# Altium schematic sheet Sheet1-control.SchDoc
size A3; SheetNumber: 2; SheetTotal: 3
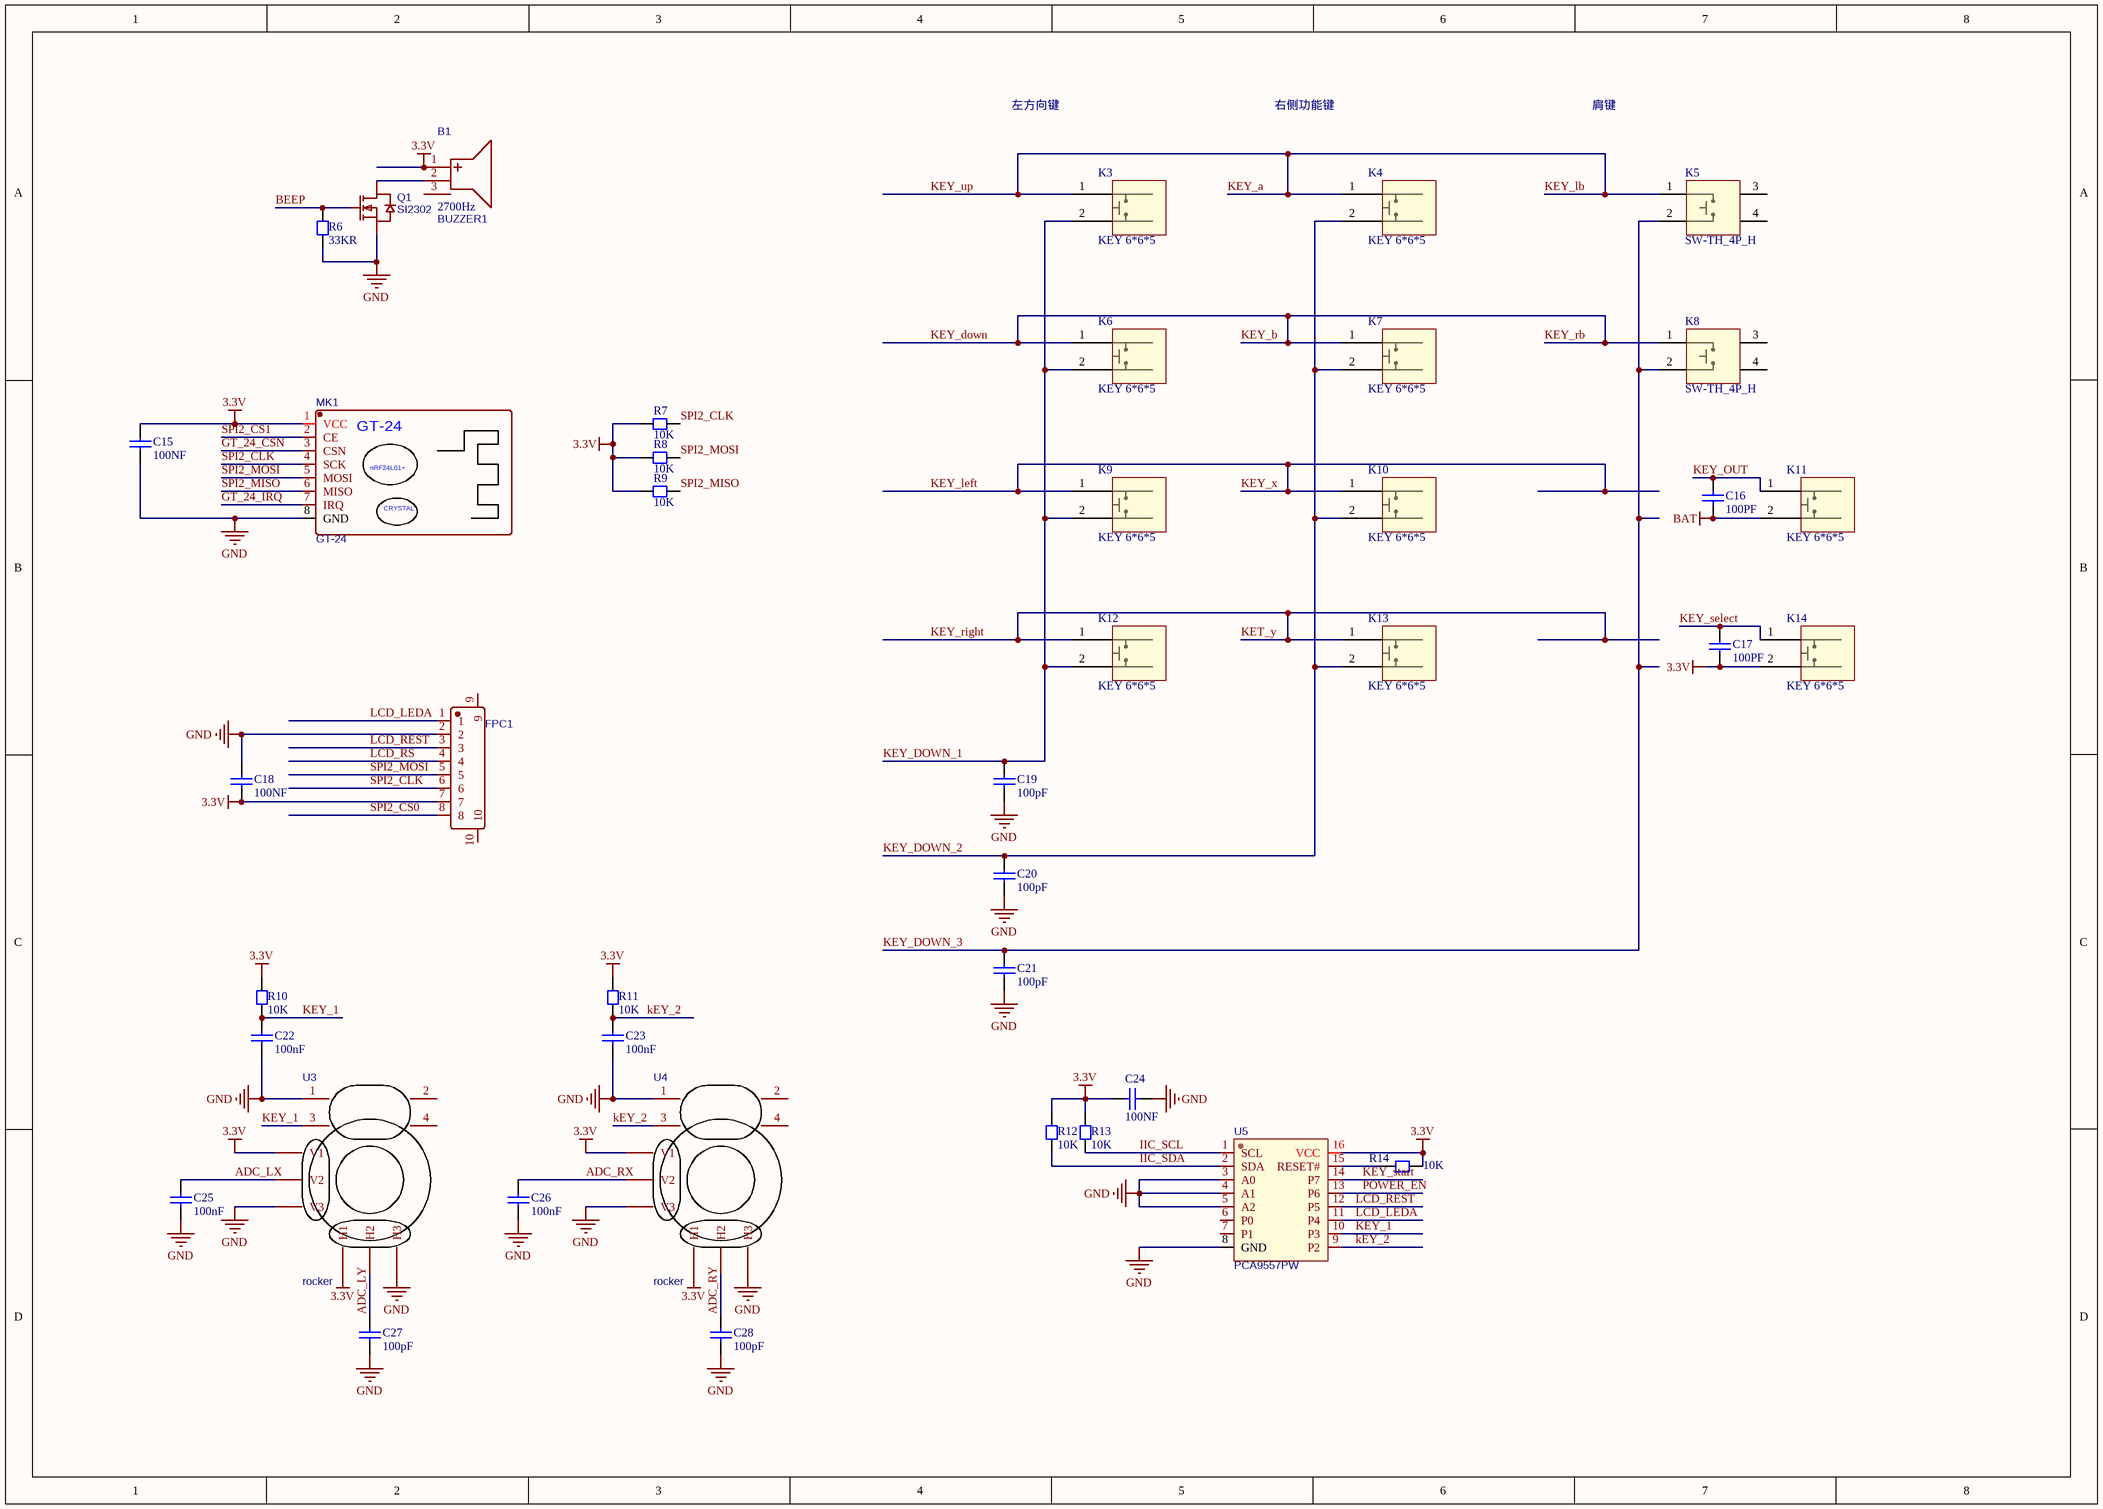
[diagram p0: Sheet1-control.SchDoc]

## Parts
B1  BUZZER1  [BUZ-SMD_GSC7525RA]
C15  100NF  [CC1608-0603]
C16  100PF  [CC1608-0603]
C17  100PF  [CC1608-0603]
C18  100NF  [CC1608-0603]
C19  100pF  [CC1608-0603]
C20  100pF  [CC1608-0603]
C21  100pF  [CC1608-0603]
C22  100nF  [CC1608-0603]
C23  100nF  [CC1608-0603]
C24  100NF  [CC1608-0603]
C25  100nF  [CC1608-0603]
C26  100nF  [CC1608-0603]
C27  100pF  [CC1608-0603]
C28  100pF  [CC1608-0603]
FPC1  FFC 05 8P  [FFC-SMD_8P-P0.50]  (value not drawn)
K3  KEY 6*6*5  [KEY 6*6*5]
K4  KEY 6*6*5  [KEY 6*6*5]
K5  SW-TH_4P_H  [SW-TH_KH-6X6X7H-ZJ]
K6  KEY 6*6*5  [KEY 6*6*5]
K7  KEY 6*6*5  [KEY 6*6*5]
K8  SW-TH_4P_H  [SW-TH_KH-6X6X7H-ZJ]
K9  KEY 6*6*5  [KEY 6*6*5]
K10  KEY 6*6*5  [KEY 6*6*5]
K11  KEY 6*6*5  [KEY 6*6*5]
K12  KEY 6*6*5  [KEY 6*6*5]
K13  KEY 6*6*5  [KEY 6*6*5]
K14  KEY 6*6*5  [KEY 6*6*5]
MK1  GT-24  [WIRELM-SMD_AS01-ML01S]
Q1  SI2302  [SOT-23]
R6  33KR  [CR1608-0603]
R7  10K  [CR1608-0603]
R8  10K  [CR1608-0603]
R9  10K  [CR1608-0603]
R10  10K  [CR1608-0603]
R11  10K  [CR1608-0603]
R12  10K  [CR1608-0603]
R13  10K  [CR1608-0603]
R14  10K  [CR1608-0603]
U3  rocker  [PCBComponent_1]
U4  rocker  [PCBComponent_1]
U5  PCA9557PW  [TSSOP-16]

## Nets
3.3V: B1.1(+) C15.2 C17.2 C18.1 C24.2 FPC1.7 K14.2 MK1.1(VCC) R7.2 R8.2 R9.2 R10.2 R11.2 R12.1 R13.1 R14.1 U3.5(V1) U3.8(H1) U4.5(V1) U4.8(H1) U5.16(VCC)
BAT: C16.2 K11.2
GND: C15.1 C18.2 C19.1 C20.1 C21.1 C22.1 C23.1 C24.1 C25.1 C26.1 C27.1 C28.1 FPC1.2 MK1.8(GND) Q1.2(S) R6.2 U3.1 U3.7(V3) U3.10(H3) U4.1 U4.7(V3) U4.10(H3) U5.3(A0) U5.4(A1) U5.5(A2) U5.8(GND)
ADC_LX: C25.2 U3.6(V2)
ADC_LY: C27.2 U3.9(H2)
ADC_RX: C26.2 U4.6(V2)
ADC_RY: C28.2 U4.9(H2)
BEEP: Q1.1(G) R6.1
GT_24_CSN: MK1.3(CSN)
GT_24_IRQ: MK1.7(IRQ)
IIC_SCL: R13.2 U5.1(SCL)
IIC_SDA: R12.2 U5.2(SDA)
KET_y: K12.1 K13.1  [also labelled KEY_right]
KEY_1: C22.2 R10.1 U3.3 U5.10(P3)
kEY_2: C23.2 R11.1 U4.3 U5.9(P2)
KEY_a: K3.1 K4.1 K5.1  [also labelled KEY_lb, KEY_up]
KEY_b: K6.1 K7.1 K8.1  [also labelled KEY_down, KEY_rb]
KEY_DOWN_1: C19.2 K3.2 K6.2 K9.2 K12.2
KEY_DOWN_2: C20.2 K4.2 K7.2 K10.2 K13.2
KEY_DOWN_3: C21.2 K5.2 K8.2
KEY_left: K9.1 K10.1  [also labelled KEY_x]
KEY_OUT: C16.1 K11.1
KEY_select: C17.1 K14.1
KEY_start: U5.14(P7)
LCD_LEDA: FPC1.1 U5.11(P4)
LCD_REST: FPC1.3 U5.12(P5)
LCD_RS: FPC1.4
POWER_EN: U5.13(P6)
SPI2_CLK: FPC1.6 MK1.4(SCK) R7.1
SPI2_CS0: FPC1.8
SPI2_CS1: MK1.2(CE)
SPI2_MISO: MK1.6(MISO) R9.1
SPI2_MOSI: FPC1.5 MK1.5(MOSI) R8.1
NetB1_2: B1.2(-) Q1.3(D)
NetR14_2: R14.2 U5.15(RESET#)

Not connected (* = marked no-connect by the designer): B1 3(EH); FPC1 9 10; K5 3 4; K8 3 4; U3 2 4; U4 2 4; U5 6(P0) 7(P1)

## Notes on the sheet
- 左方向键
- 右侧功能键
- 肩键
- (in symbol GT-24) nRF24L01+; CRYSTAL

## Library data of the parts
B1 = BUZZER1: 2700Hz; Manufacturer: INGHAi(赢海); Manufacturer Part: GSC7525RA-16R2700; Contributor: LCSC; nameAlias: Value; Supplier: LCSC; Supplier Part: C255313; spicePre: B; spiceSymbolName: GSC7525RA-16R2700
C15-C28 = Cap Chip 0603: 0603封装的电容; Published: 8-Jun-2000; Revision: July-2002: Re-released for DXP Platform.; Publisher: Altium Limited
FPC1 = FFC 05 8P: Manufacturer: TXGA(特思嘉); Manufacturer Part: FFC05001-08SBB124W5M-H; Contributor: LCSC; Supplier: LCSC; Supplier Part: C456420; JLCPCB Part Class: Extended Part; spicePre: F; spiceSymbolName: FFC05001-08SBB124W5M-H
K3 K4 K6 K7 K9-K14 = KEY 6*6*5: 无声轻触开关
K5 K8 = SW-TH_4P_H: 卧式轻触开关
MK1 = GT-24: 工业级GT-24数传无线模块 2.4G NRF24L01&PA+LNA; Manufacturer: Ashining(泽耀科技); Manufacturer Part: AS01-ML01S; Supplier: LCSC; Supplier Part: C84802; JLCPCB Part Class: Extended Part; spicePre: M; spiceSymbolName: AS01-ML01S
Q1 = SI2302: N沟道 / 漏源电压(Vdss) 20V / 连续漏极电流(Id) 2.8A / 功率(Pd) 900mW / 导通电阻(RDS(on)@Vgs,Id) 55mΩ@4.5V,2.8A / 阈值电压(Vgs(th)@Id) 1.2V@250uA / 输入电容(Ciss@Vds) 260pF@10V; Manufacturer: TWGMC(台湾迪嘉); Manufacturer Part: SI2306; Contributor: LCSC; Supplier: LCSC; Supplier Part: C727154; JLCPCB Part Class: Extended Part; spicePre: Q; spiceSymbolName: SI2306_C727154
R6 = Chip resistor: 贴片电阻
R7-R14 = Resistor Chip 0603: 0603封装电阻; Published: 8-Jun-2000; Revision: July-2002: Re-released for DXP Platform.; Publisher: Altium Limited
U3 U4 = rocker: Manufacturer Part: 摇杆; Contributor: Alex_Ai; spicePre: U; spiceSymbolName: 摇杆_直插_圆半径13_10电气脚_4固定脚 COPY
U5 = PCA9557PW: TSSOP-16 8位I2C总线和SMBus I/O扩展器芯片; Manufacturer: TI(德州仪器); Contributor: LCSC; Supplier: LCSC; Supplier Part: C1542488; Manufacturer Part: PCA9557PW; JLCPCB Part Class: Extended Part; spicePre: U; spiceSymbolName: PCA9557PW